# Altium schematic sheet 18_HD4_PUMP.SchDoc
size 420 x 297 mm; SheetNumber: 29; SheetTotal: 36
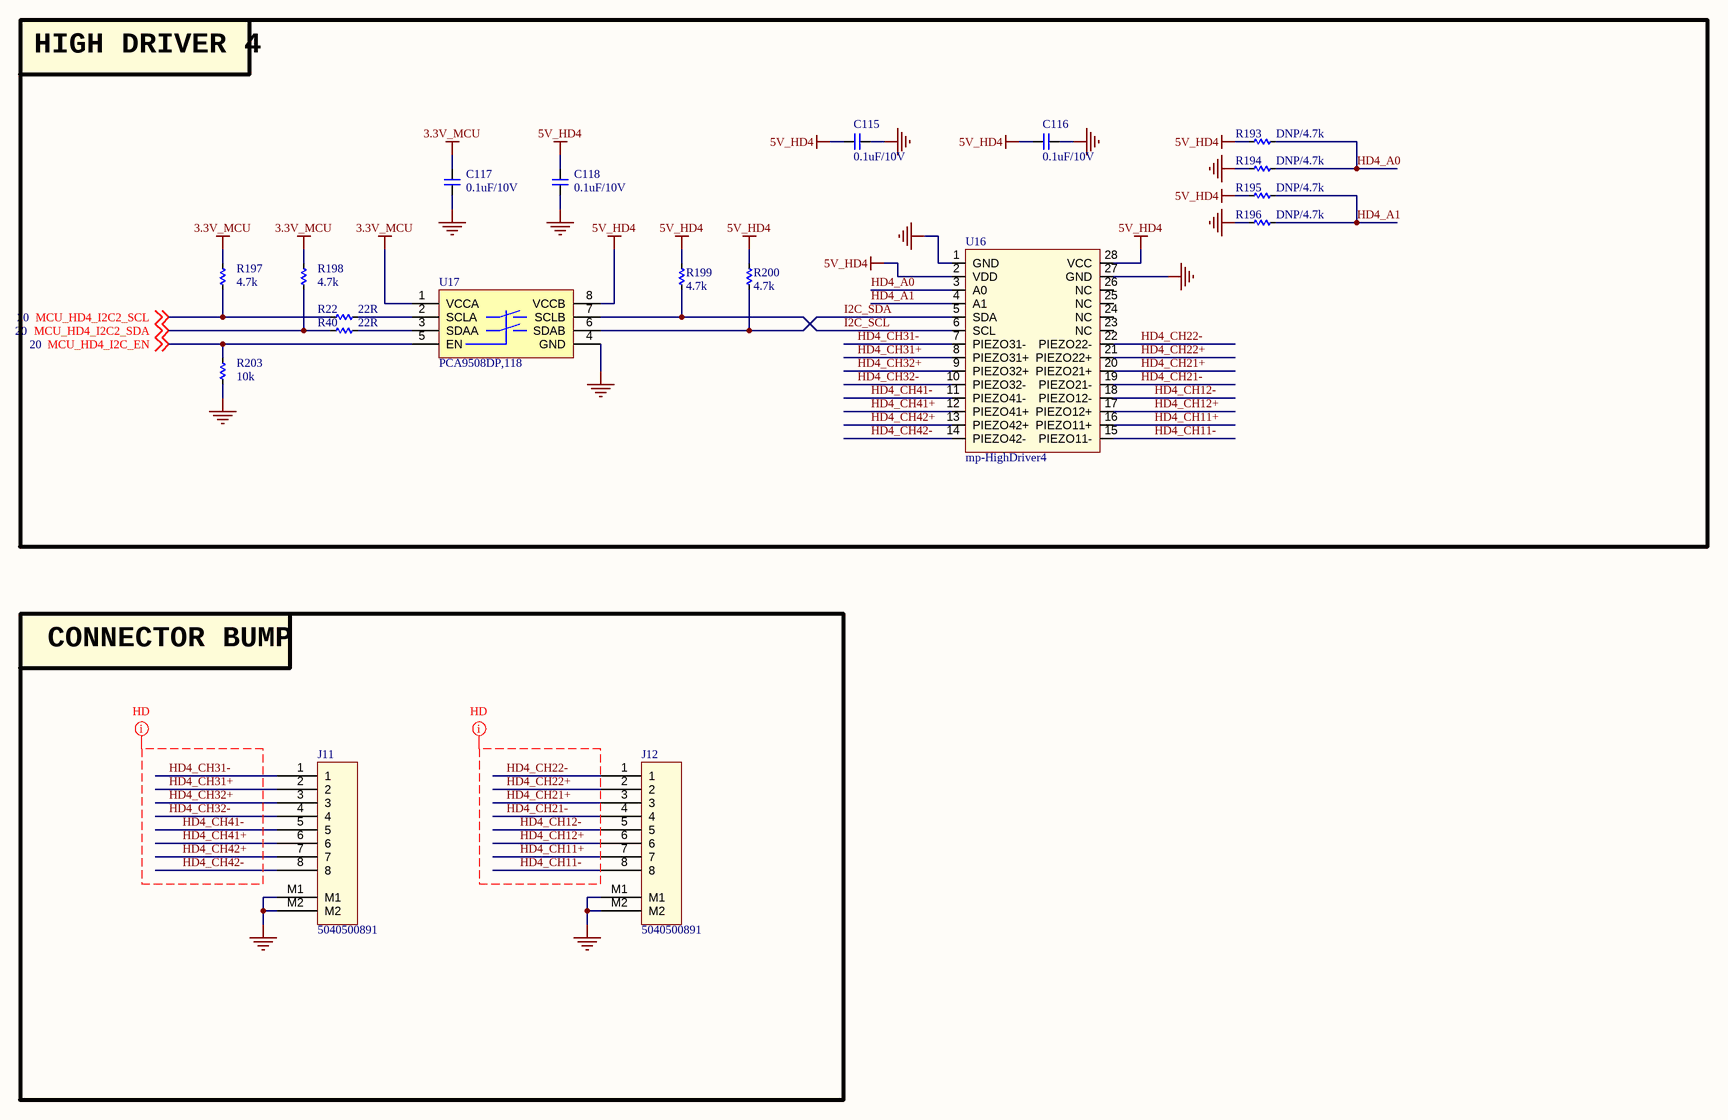
[diagram p0: 18_HD4_PUMP.SchDoc]

## Parts
C115  0.1uF/10V  [CAP_C_1005X60]
C116  0.1uF/10V  [CAP_C_1005X60]
C117  0.1uF/10V  [CAP_C_1005X60]
C118  0.1uF/10V  [CAP_C_1005X60]
J11  5040500891  [MOLEX_5040500891]
J12  5040500891  [MOLEX_5040500891]
R22  22R  [RES_C_1005X40]
R40  22R  [RES_C_1005X40]
R193  DNP/4.7k  [RES_C_1005X40]
R194  DNP/4.7k  [RES_C_1005X40]
R195  DNP/4.7k  [RES_C_1005X40]
R196  DNP/4.7k  [RES_C_1005X40]
R197  4.7k  [RES_C_1005X40]
R198  4.7k  [RES_C_1005X40]
R199  4.7k  [RES_C_1005X40]
R200  4.7k  [RES_C_1005X40]
R203  10k  [RES_C_1005X40]
U16  mp-HighDriver4  [MP_HIGHDRIVER4]
U17  PCA9508DP,118  [TSOP8]

## Blocks framed on the sheet
HIGH DRIVER 4: C115-C118 R22 R40 R193-R200 R203 U16 U17
CONNECTOR BUMP: J11 J12

## Nets
3.3V_MCU: C117.2 R197.1 R198.1 U17.1(VCCA)
5V_HD4: C115.2 C116.2 C118.2 R193.1 R195.1 R199.1 R200.1 U16.2(VDD) U16.28(VCC) U17.8(VCCB)
GND: C115.1 C116.1 C117.1 C118.1 J11.M1 J11.M2 J12.M1 J12.M2 R194.1 R196.1 R203.2 U16.1(GND) U16.27(GND) U17.4(GND)
HD4_A0: R193.2 R194.2 U16.3(A0)
HD4_A1: R195.2 R196.2 U16.4(A1)
HD4_CH11+: J12.7 U16.16(PIEZO11+)
HD4_CH11-: J12.8 U16.15(PIEZO11-)
HD4_CH12+: J12.6 U16.17(PIEZO12+)
HD4_CH12-: J12.5 U16.18(PIEZO12-)
HD4_CH21+: J12.3 U16.20(PIEZO21+)
HD4_CH21-: J12.4 U16.19(PIEZO21-)
HD4_CH22+: J12.2 U16.21(PIEZO22+)
HD4_CH22-: J12.1 U16.22(PIEZO22-)
HD4_CH31+: J11.2 U16.8(PIEZO31+)
HD4_CH31-: J11.1 U16.7(PIEZO31-)
HD4_CH32+: J11.3 U16.9(PIEZO32+)
HD4_CH32-: J11.4 U16.10(PIEZO32-)
HD4_CH41+: J11.6 U16.12(PIEZO41+)
HD4_CH41-: J11.5 U16.11(PIEZO41-)
HD4_CH42+: J11.7 U16.13(PIEZO42+)
HD4_CH42-: J11.8 U16.14(PIEZO42-)
I2C_SCL: R199.2 U16.6(SCL) U17.7(SCLB)
I2C_SDA: R200.2 U16.5(SDA) U17.6(SDAB)
MCU_HD4_I2C2_SCL: R22.1 R197.2 ; off-sheet MCU_HD4_I2C2_SCL
MCU_HD4_I2C2_SDA: R40.1 R198.2 ; off-sheet MCU_HD4_I2C2_SDA
MCU_HD4_I2C_EN: R203.1 U17.5(EN) ; off-sheet MCU_HD4_I2C_EN
NetR22_2: R22.2 U17.2(SCLA)
NetR40_2: R40.2 U17.3(SDAA)

Not connected (* = marked no-connect by the designer): U16 23(NC) 24(NC) 25(NC) 26(NC)

## Layout directives
net class HD: HD4_CH11+, HD4_CH11-, HD4_CH12+, HD4_CH12-, HD4_CH21+, HD4_CH21-, HD4_CH22+, HD4_CH22-, HD4_CH31+, HD4_CH31-, HD4_CH32+, HD4_CH32-, HD4_CH41+, HD4_CH41-, HD4_CH42+, HD4_CH42-

## Notes on the sheet
- Project:
- Sub-system:
- Design by:
- Sheet title:
- Sheet
- of
- Checked by:
- Approved by:
- Revision:
- Document No:
- Size:
- Date:
- A3

## Library data of the parts
C115-C118 = _CAP_C_2: CAP
J11 J12 = Header 8x1_2M
R22 R40 R193-R200 R203 = _RES_B_2: RES
U16 = mp_HighDriver4